# EAGLE design I2C-9685-PWM (EAGLE 7.7.0)
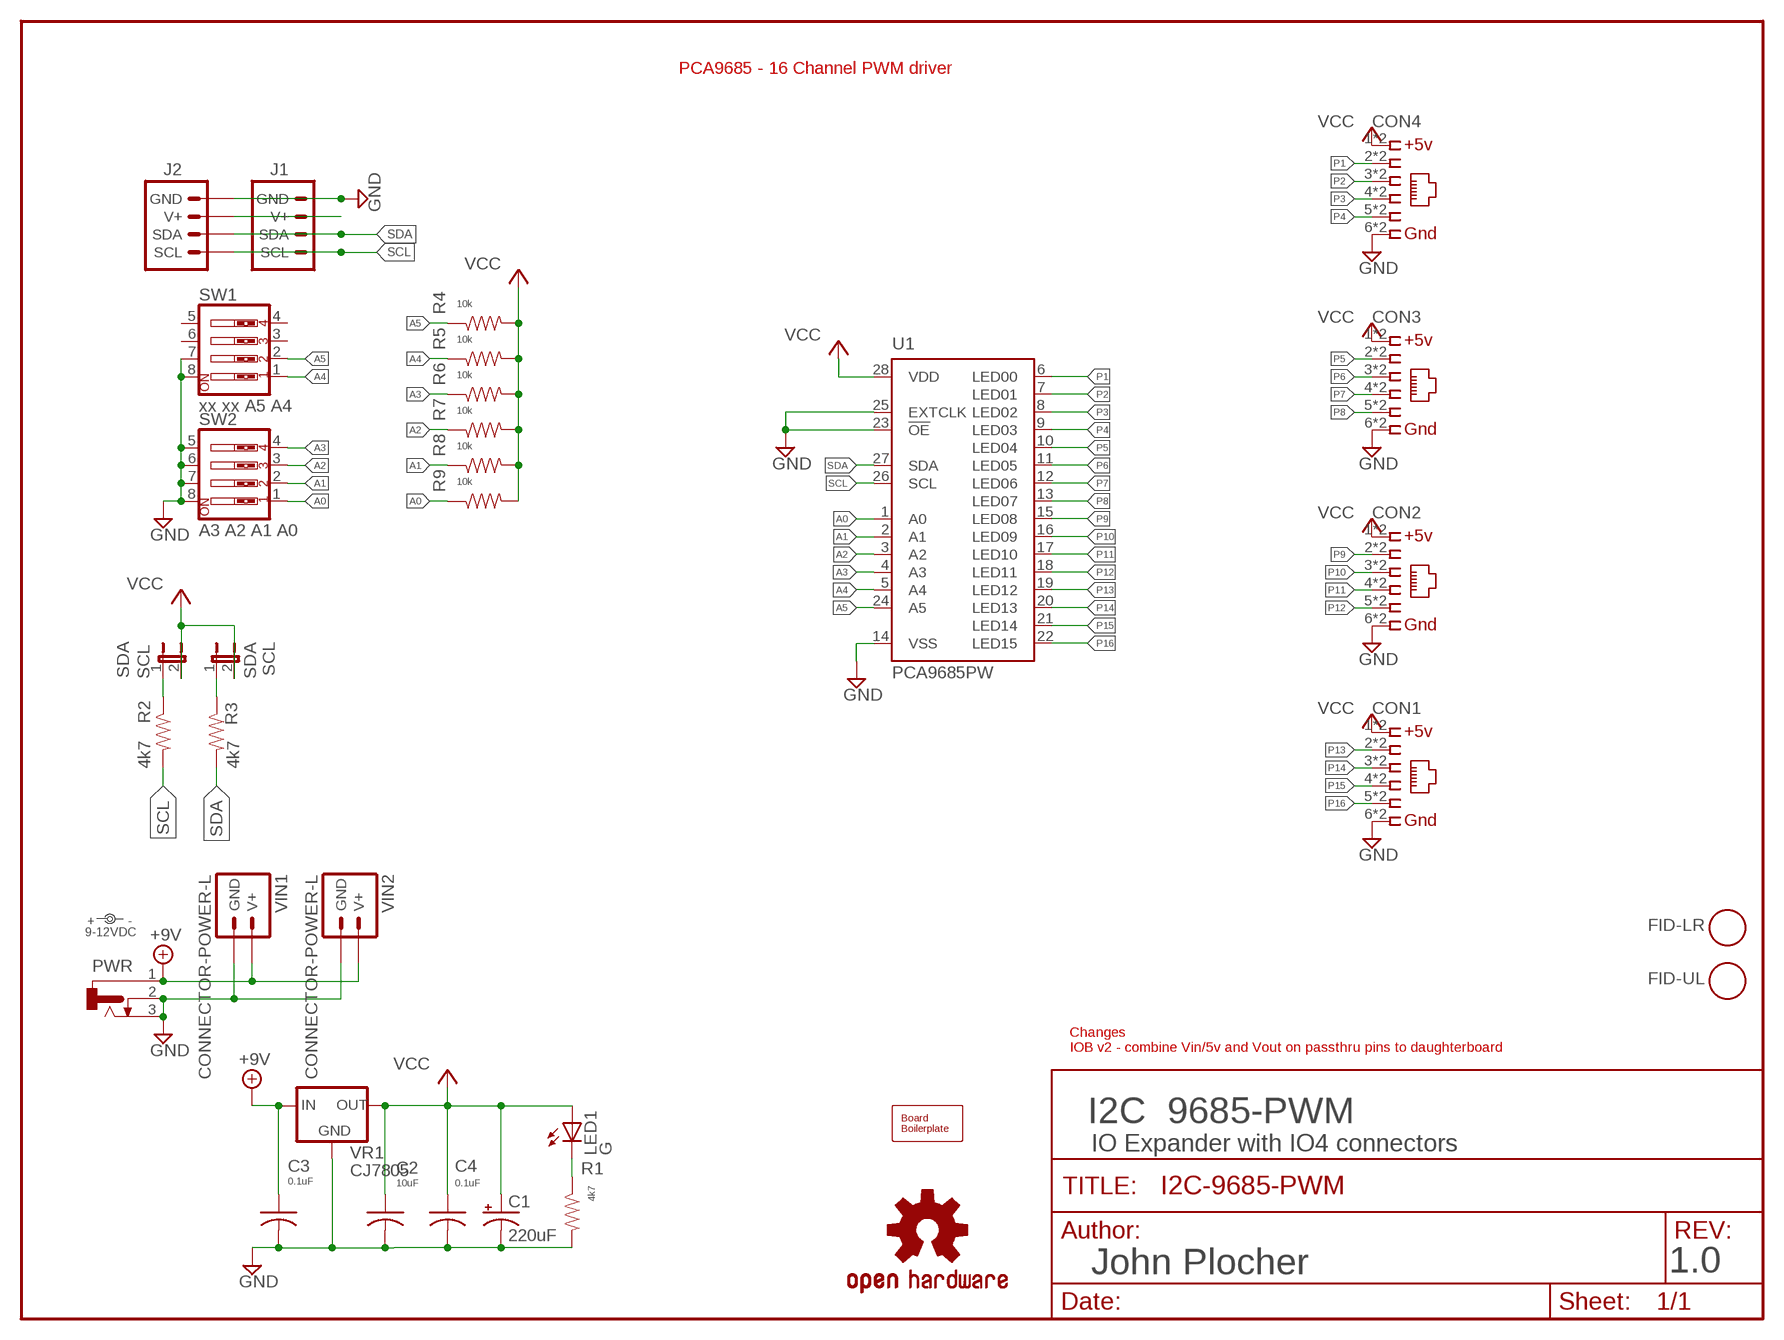
[diagram p0: schematic, sheet 1]

## Parts
BOARD1  BOARD80X100-IOB  [BOARD-DINRAIL-3.17IN-IOB]
C1  220uF  CAP-POL0810  [0810-CAP]
C2  10uF  CAP0805  [0805-CAP]
C3  0.1uF  CAP0805  [0805-CAP]
C4  0.1uF  CAP0805  [0805-CAP]
CON1  CONNECTOR-IO4IPINS  [RJ24-INVERTED-PINS]
CON2  CONNECTOR-IO4IPINS  [RJ24-INVERTED-PINS]
CON3  CONNECTOR-IO4IPINS  [RJ24-INVERTED-PINS]
CON4  CONNECTOR-IO4IPINS  [RJ24-INVERTED-PINS]
FID-LR  FIDUCIAL  [FIDUCIAL_1MM]
FID-UL  FIDUCIAL  [FIDUCIAL_1MM]
J1  CONNECTOR-I2CLEFT  [I2C-L]
J2  CONNECTOR-I2CLEFT  [I2C-L]
LED1  G  LED0603-LED  [0603-LED]
PWR  CONNECTOR-DC-POWER-RA  [DCJ0202]
R1  4k7  R0603-RES  [0603-RES]
R2  4k7  R0603-RES  [0603-RES]
R3  4k7  R0603-RES  [0603-RES]
R4  10k  R0603-RES  [0603-RES]
R5  10k  R0603-RES  [0603-RES]
R6  10k  R0603-RES  [0603-RES]
R7  10k  R0603-RES  [0603-RES]
R8  10k  R0603-RES  [0603-RES]
R9  10k  R0603-RES  [0603-RES]
SCL  SDA  JUMPER-2PTH_LOCK  [1X02_LOCK]
SDA  SCL  JUMPER-2PTH_LOCK  [1X02_LOCK]
SW1  xx xx A5 A4  SW_DIP-4  [EDG-04]
SW2  A3 A2 A1 A0  SW_DIP-4  [EDG-04]
U1  PCA9685PW  [TSSOP28]
U$1  OSHW-LOGOL  [OSHW-LOGO-L]
VIN  9-12VDC  DOC-POWER_LABEL  [PWR_LABEL]
VIN1  CONNECTOR-POWER-L  [POWER-R2]
VIN2  CONNECTOR-POWER-L  [POWER-R2]
VR1  CJ7805  VREG-DPAK-5  [TO-252]

## Nets
+9V [Power]: C3.1 PWR.1 VIN1.V+ VIN1.V+@1(V+) VIN1.V+@2(V+) VIN1.V+@3(V+) VIN2.V+ VIN2.V+@1(V+) VIN2.V+@2(V+) VIN2.V+@3(V+) VR1.1(IN)
A0 [signals]: R9.1 SW2.1 U1.1(A0)
A1 [signals]: R8.1 SW2.2 U1.2(A1)
A2 [signals]: R7.1 SW2.3 U1.3(A2)
A3: R6.1 SW2.4 U1.4(A3)
A4: R5.1 SW1.1 U1.5(A4)
A5: R4.1 SW1.2 U1.24(A5)
GND [Power]: C1.- C2.2 C3.2 C4.2 CON1.6 CON1.6@1 CON2.6 CON2.6@1 CON3.6 CON3.6@1 CON4.6 CON4.6@1 J1.GND J1.GND@1(GND) J2.GND J2.GND@1(GND) PWR.2 PWR.3 R1.2 SW1.7 SW1.8 SW2.5 SW2.6 SW2.7 SW2.8 U1.14(VSS) U1.23(!OE) U1.25(EXTCLK) VIN1.GND VIN1.GND@1(GND) VIN1.GND@2(GND) VIN1.GND@3(GND) VIN2.GND VIN2.GND@1(GND) VIN2.GND@2(GND) VIN2.GND@3(GND) VR1.2(GND)
N$1: LED1.C R1.1
N$19 [signals]: R3.1 SCL.1
N$20 [signals]: R2.1 SDA.1
P1 [signals]: CON4.2 CON4.2@1 U1.6(LED00)
P2 [signals]: CON4.3 CON4.3@1 U1.7(LED01)
P3 [signals]: CON4.4 CON4.4@1 U1.8(LED02)
P4 [signals]: CON4.5 CON4.5@1 U1.9(LED03)
P5 [signals]: CON3.2 CON3.2@1 U1.10(LED04)
P6 [signals]: CON3.3 CON3.3@1 U1.11(LED05)
P7 [signals]: CON3.4 CON3.4@1 U1.12(LED06)
P8 [signals]: CON3.5 CON3.5@1 U1.13(LED07)
P9 [signals]: CON2.2 CON2.2@1 U1.15(LED08)
P10 [signals]: CON2.3 CON2.3@1 U1.16(LED09)
P11 [signals]: CON2.4 CON2.4@1 U1.17(LED10)
P12 [signals]: CON2.5 CON2.5@1 U1.18(LED11)
P13 [signals]: CON1.2 CON1.2@1 U1.19(LED12)
P14 [signals]: CON1.3 CON1.3@1 U1.20(LED13)
P15 [signals]: CON1.4 CON1.4@1 U1.21(LED14)
P16 [signals]: CON1.5 CON1.5@1 U1.22(LED15)
SCL [signals]: J1.SCL J1.SCL@1(SCL) J2.SCL J2.SCL@1(SCL) R2.2 U1.26(SCL)
SDA [signals]: J1.SDA J1.SDA@1(SDA) J2.SDA J2.SDA@1(SDA) R3.2 U1.27(SDA)
V+I2C: J1.V+ J1.V+@1(V+) J2.V+ J2.V+@1(V+)
VCC [Power]: C1.+ C2.1 C4.1 CON1.1 CON1.1@1 CON2.1 CON2.1@1 CON3.1 CON3.1@1 CON4.1 CON4.1@1 LED1.A R4.2 R5.2 R6.2 R7.2 R8.2 R9.2 SCL.2 SDA.2 U1.28(VDD) VR1.3(OUT)
Unconnected: SW1.3 SW1.4 SW1.5 SW1.6

## Notes on the sheet
- PCA9685 - 16 Channel PWM driver
- Changes
  IOB v2 - combine Vin/5v and Vout on passthru pins to daughterboard
- I2C  9685-PWM
- IO Expander with IO4 connectors
- John Plocher | 1.0

## Library data of the parts
BOARD1 = SPCoast:BOARD
C1 = SPCoast:CAP-POL*
C2-C4 = SPCoast:CAP*
CON1-CON4 = SPCoast:CONNECTOR-IO4
FID-LR FID-UL = SPCoast:FIDUCIAL: For use by pick and place machines to calibrate the vision/machine, 1mm By microbuilder.eu
J1 J2 = SPCoast:CONNECTOR-I2C
LED1 = SPCoast:LED*
PWR = SPCoast:CONNECTOR-DC-POWER: DC POWER JACK
R1-R9 = SPCoast:R*: Resistor Basic schematic elements and footprints for 0603, 1206, and PTH 1/10th watt (small) resistors.
SCL SDA = SPCoast:JUMPER-2: Jumper Basic 0.1" spaced jumper. Use with breakaway headers.
SW1 SW2 = SPCoast:SW_DIP-4: DIP SWITCH
U1 = SPCoast:PCA9685
U$1 = SparkFun:OSHW-LOGO: Open Source Hardware Logo This logo indicates the piece of hardware it is found on incorporates a OSHW license and/or adheres to the definition of open source hardware found here: http://freedomdefined.org/OSHW
VIN = SPCoast:DOC-POWER_LABEL
VIN1 VIN2 = SPCoast:CONNECTOR-POWER
VR1 = SPCoast:VREG-?-*: Voltage Regulator Standard linear regulator. 7805 uses IGO pinout LM1117 uses GOI pinout

## Net classes
0 default: width 0.254 mm, drill 0.4 mm, clearance 0.127 mm
1 Power: width 0.254 mm, drill 0.4 mm, clearance 0.127 mm
2 signals: width 0.254 mm, drill 0.4 mm, clearance 0.127 mm

## Board
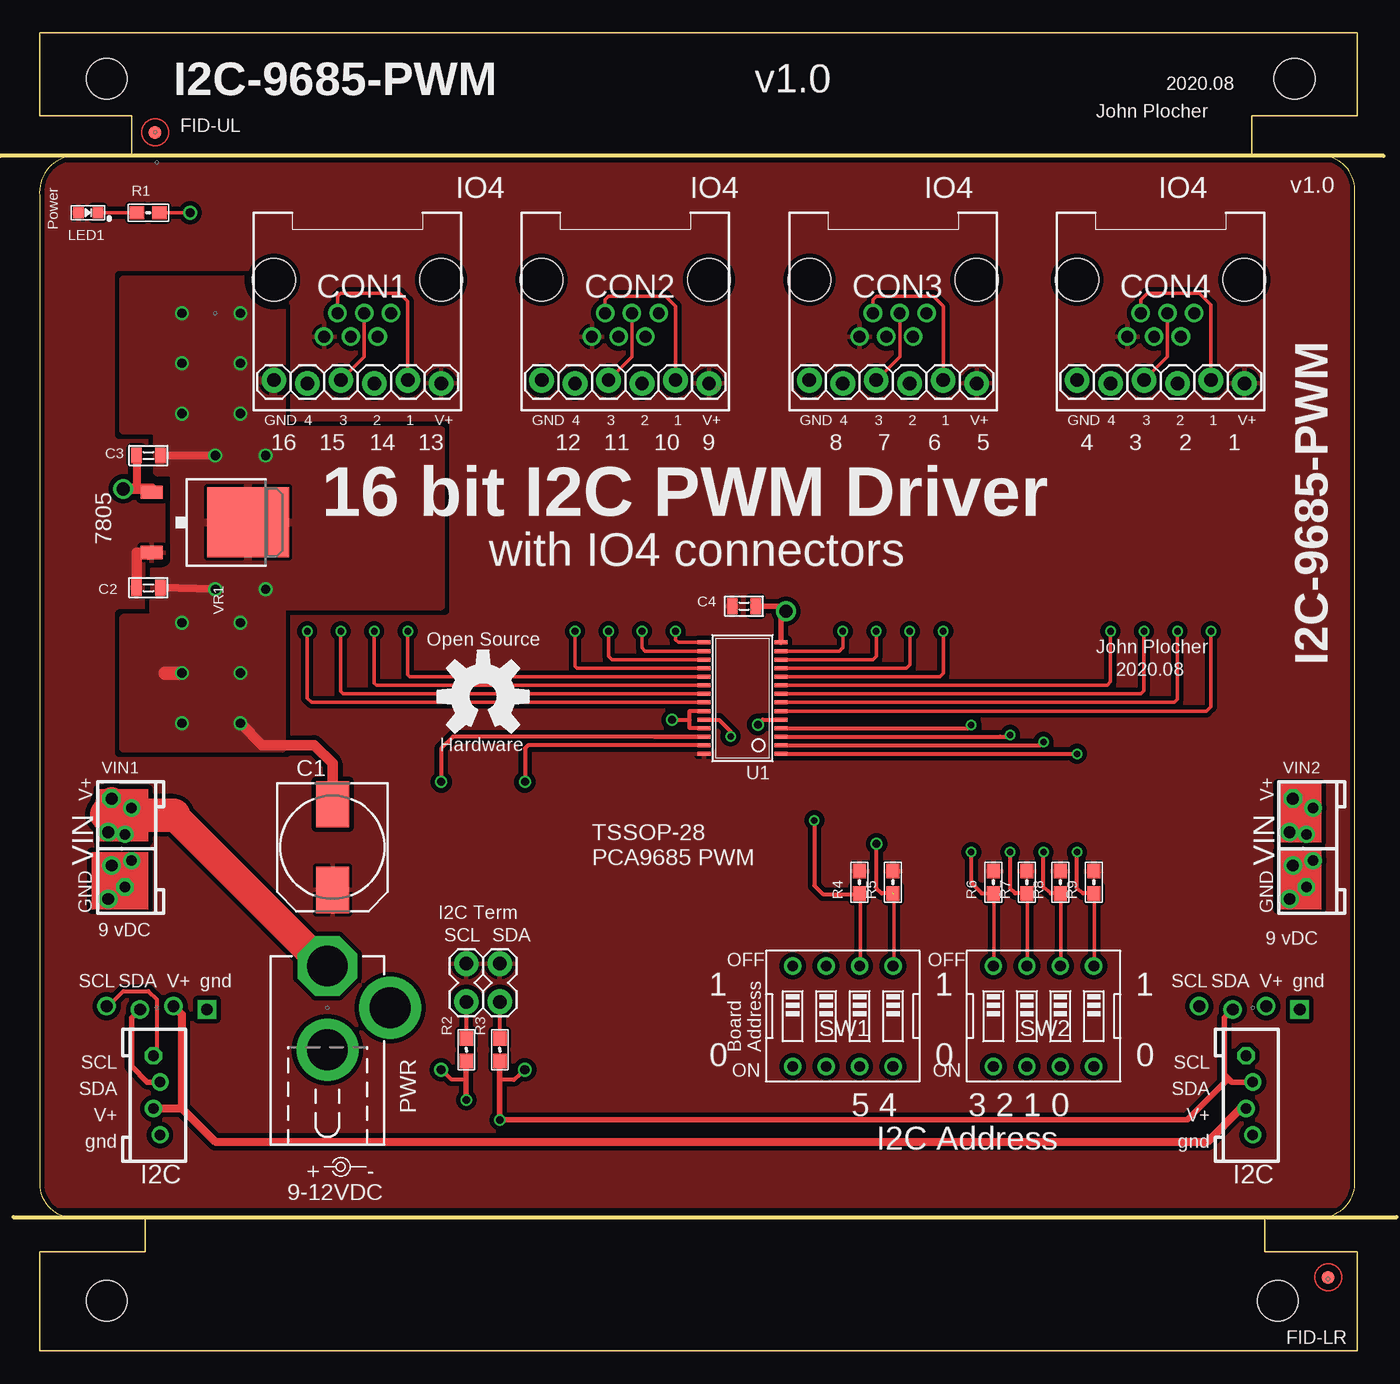
[diagram p1: board, top side]
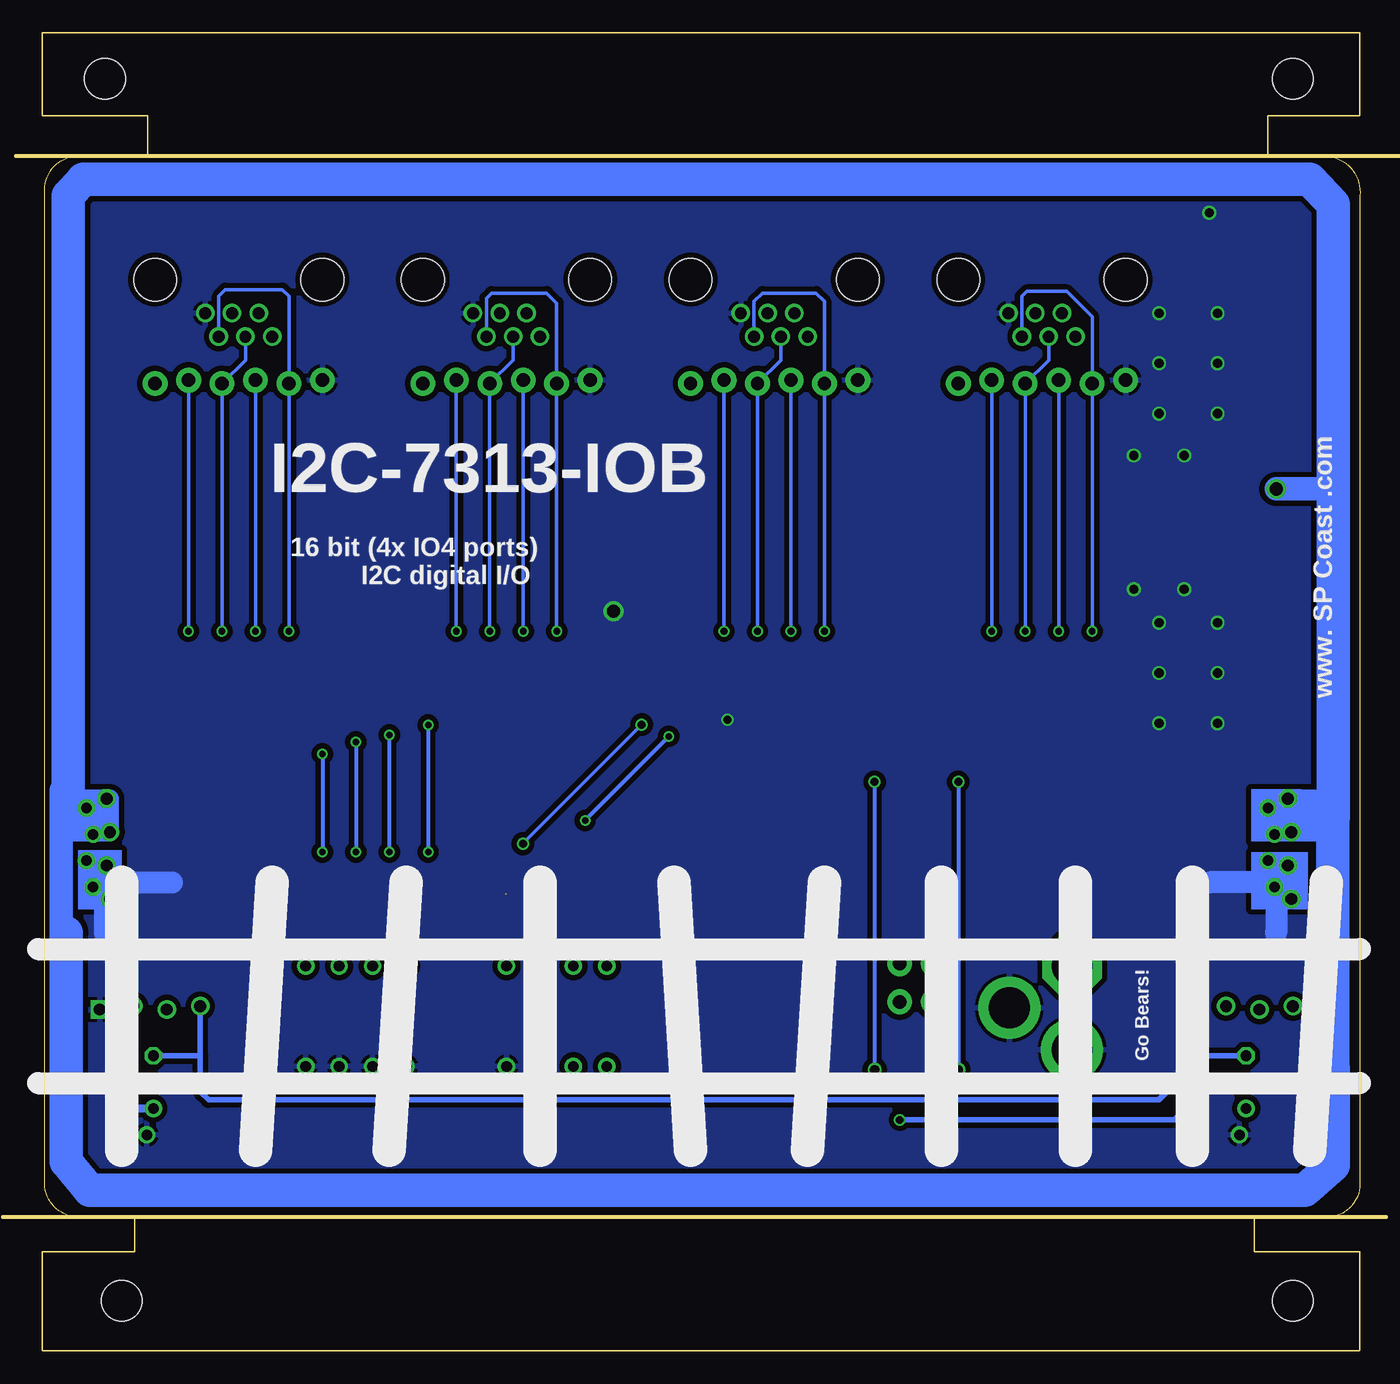
[diagram p2: board, bottom side, seen from below]

Size 100.01 x 100 mm. Coordinates in mm from the lower left corner, seen from the top.
Copper layers (1*16): Top 0.035mm / dielectric 1.5mm / Bottom 0.035mm
Design rules "Fusion_eagle_rule_v1.1": minimum track width 6mil, minimum drill 12mil, track to track 6mil, track to pad 6mil, pad to pad 6mil, via to via 6mil, smd to smd 0mil, copper to edge 10mil, drill to drill 10mil, minimum pad ring 10mil, minimum via ring 6mil, stop-mask expansion 2mil, vias tented up to drill 100mil, thermal gap 10mil

### Footprints (pad centres in the part's own frame; a part is rotated, then mirrored left to right if it is on the bottom)
BOARD-DINRAIL-3.17IN-IOB = hole 3.1: 5.08,96.52; 95.25,96.52; 5.08,3.81; 93.98,3.81
0810-CAP = smd 3.5 x 2.5: + 3.25,0; - -3.25,0
0805-CAP = smd 0.8 x 1.2: 1 -0.9,0; 2 0.9,0
RJ24-INVERTED-PINS = drill 1.016 pad 1.88: 1 6.35,-4.064; 2 3.81,-3.81; 3 1.27,-4.064; 4 -1.27,-3.81; 5 -3.81,-4.064; 6 -6.35,-3.81 | drill 0.9 pad 1.4: 1@1 -2.54,-0.508; 2@1 -1.524,1.27; 3@1 -0.508,-0.508; 4@1 0.508,1.27; 5@1 1.524,-0.508; 6@1 2.54,1.27 | hole 3.251: 6.35,3.81; -6.35,3.81
FIDUCIAL_1MM = smd 1 x 1: 1 0,0
I2C-L = drill 0.9 square: GND 3.81,-0.127 | drill 0.8 pad 1.27: GND@1 0.254,-9.635; SDA@1 0.254,-5.635; V+@1 -0.254,-7.635 | drill 0.9: SCL -3.81,0.127; SDA -1.27,-0.127; V+ 1.27,0.127 | drill 0.8 pad 1.27 octagon: SCL@1 -0.254,-3.635
0603-LED = smd 0.8 x 0.8: A 0.75,0; C -0.75,0
DCJ0202 = drill 3.1 pad 4.5 octagon: 1 0,3.175 | drill 3.1 pad 4.7: 2 4.763,0; 3 0,-3.175
0603-RES = smd 1.1 x 1: 1 -0.85,0; 2 0.85,0
1X02_LOCK = drill 1.016 pad 1.88: 1 -0.178,0; 2 2.718,0
EDG-04 = drill 0.813: 1 -3.81,-3.81; 2 -1.27,-3.81; 3 1.27,-3.81; 4 3.81,-3.81; 5 3.81,3.81; 6 1.27,3.81; 7 -1.27,3.81; 8 -3.81,3.81
TSSOP28 = smd 0.305 x 0.991: 1 -4.225,-2.918; 2 -3.575,-2.918; 3 -2.925,-2.918; 4 -2.275,-2.918; 5 -1.625,-2.918; 6 -0.975,-2.918; 7 -0.325,-2.918; 8 0.325,-2.918; 9 0.975,-2.918; 10 1.625,-2.918; 11 2.275,-2.918; 12 2.925,-2.918; 13 3.575,-2.918; 14 4.225,-2.918; 15 4.225,2.918; 16 3.575,2.918; 17 2.925,2.918; 18 2.275,2.918; 19 1.625,2.918; 20 0.975,2.918; 21 0.325,2.918; 22 -0.325,2.918; 23 -0.975,2.918; 24 -1.625,2.918; 25 -2.275,2.918; 26 -2.925,2.918; 27 -3.575,2.918; 28 -4.225,2.918
POWER-R2 = drill 0.9: GND -0.762,-1.27; GND@1 -1.016,-3.81; V+ -1.016,1.27 | drill 0.8 pad 1.27: GND@2 0.762,-0.904; V+@2 0.762,3.096; V+@3 0.254,1.096 | drill 0.8 pad 1.27 octagon: GND@3 0.254,-2.904 | drill 0.9 octagon: V+@1 -0.762,3.81
TO-252 = smd 1.651 x 1.016: 1 -4.826,2.286; 3 -4.826,-2.286 | smd 6.2 x 5.3: 2 2.5,0

### Placement (x,y rotation side)
BOARD1  0.01,0 0 top
C1  22.24,38.23 270 top
C2  8.27,57.91 0 top
C3  8.27,67.94 0 top
C4  53.48,56.52 0 top
CON1  24.14,77.47 0 top
CON2  44.46,77.47 0 top
CON3  64.78,77.47 0 top
CON4  85.1,77.47 0 top
FID-LR  97.8,5.59 0 top
FID-UL  8.78,92.46 0 top
J1  8.9,26.04 0 top
J2  91.83,26.04 0 top
LED1  3.7,86.36 180 top
PWR  21.86,26.04 0 top
R1  8.27,86.36 0 top
R2  32.4,22.86 270 top
R3  34.94,22.86 270 top
R4  62.24,35.56 90 top
R5  64.78,35.56 90 top
R6  72.4,35.56 90 top
R7  74.94,35.56 90 top
R8  77.48,35.56 90 top
R9  80.02,35.56 90 top
SCL  34.94,26.67 90 top
SDA  32.4,26.67 90 top
SW1  60.97,25.4 180 top
SW2  76.21,25.4 180 top
U1  53.35,49.53 90 top
U$1  33.67,49.66 0 top
VIN  22.87,13.97 90 top
VIN1  6.24,38.1 0 top
VIN2  95.9,38.1 0 top
VR1  13.35,62.87 0 top

### Tracks (layer width: path | path; a pad name or v marks a point on that pad's centre or on a via)
+9V  (via drill 1)
  Top 0.406: 8.51,65.14 VR1.1 8.52,65.41
  Top 0.61: C3.1 7.37,65.41
  Top 0.813: v6.36,65.41 7.37,65.41 8.52,65.41
  Top 1.778: 5.09,40.7 5.09,41.53 VIN1.V+@1
  Top 2.184: PWR.1 21.6,29.21 10.17,40.64
  Top 2.54: 10.17,40.64 5.16,40.64 5.09,40.7
  Bottom 0.254: 3.26,39.37 3.26,39.42 2.06,39.36
  Bottom 0.61: 98.06,41.78 97.37,41.1 97.34,41.1
  Bottom 0.813: 91.96,88.9 92.72,88.9 | 70.37,88.9 69.86,88.9 | 48.78,88.9 49.54,88.9 | 27.19,88.9 26.68,88.9 | 5.47,39.37 arc90 5.65,39.2 VIN1.V+@3 | VIN1.V+@2 VIN1.V+@1 | VIN2.V+ VIN2.V+@3
  Bottom 1.422: 2.68,40.64 2.68,41.91 VIN1.V+@1 | 5.47,39.37 VIN1.V+ 3.26,39.37 2.55,39.37 | 6.49,40.7 2.62,40.7 | 98.06,41.91 VIN2.V+@1 94.88,41.91 VIN2.V+ 97.8,39.37 97.8,40.64 95.26,40.64 95.26,41.2 VIN2.V+@2
  Bottom 1.778: v6.36,65.41 2.05,65.41 | 98.18,31.75 98.57,32 98.57,42.55
  Bottom 1.93: 2.05,41.27 2.62,40.7 2.68,40.64
  Bottom 2.184: 2.05,29.21 arc-45 2.05,29.21
  Bottom 2.54: 98.06,41.78 98.06,41.91 98.06,87.63 96.91,88.9 92.72,88.9 69.86,88.9 49.54,88.9 26.68,88.9 3.82,88.9 2.05,87 2.05,65.41 2.05,41.27 2.06,39.36 2.05,29.21 2.05,14.1 4.2,12.19 96.41,12.19 98.18,14.35 98.18,31.75
A0  (via drill 0.5)
  Top 0.254: SW2.1 80.07,29.26 80.07,34.65 R9.1
  Top 0.305: R9.1 79.2,34.71 78.75,35.08 v78.75,37.85 | U1.1 v78.75,45.3
  Bottom 0.305: v78.75,45.3 v78.75,37.85
A1  (via drill 0.5)
  Top 0.254: R8.1 77.53,34.65 77.53,29.26 SW2.2
  Top 0.305: R8.1 76.76,34.71 76.21,35.18 v76.21,37.85 | U1.2 75.83,45.97 75.98,45.97 v76.21,46.21
  Bottom 0.305: v76.21,46.21 v76.21,37.85
A2  (via drill 0.5)
  Top 0.254: R7.1 74.99,34.65 74.99,29.26 SW2.3
  Top 0.305: R7.1 74.07,34.71 73.67,35.08 v73.67,37.85 | U1.3 72.91,46.61 73.42,46.61 v73.67,46.74
  Bottom 0.305: v73.67,46.74 v73.67,37.85
A3  (via drill 0.5)
  Top 0.254: 72.35,34.75 R6.1 72.45,34.65 72.45,29.26 SW2.4
  Top 0.305: U1.4 70.12,47.24 70.46,47.24 v70.73,47.5 | R6.1 72.39,34.72 71.51,34.72 70.73,35.51 v70.73,37.85
  Bottom 0.305: v70.73,47.5 v70.73,37.85
A4  (via drill 0.6)  (1 unrouted)
  Top 0.254: 64.83,34.65 64.83,29.26 SW1.1
  Top 0.305: R5.1 63.91,34.71 63.54,35.08 v63.54,38.48 | v54.52,47.52 54.9,47.91 U1.5
  Bottom 0.254: v54.52,47.52 63.54,38.51 v63.54,38.48
A5  (via drill 0.5)
  Top 0.254: R4.1 62.29,34.65 62.29,29.26 SW1.2
  Top 0.305: U1.24 51.58,47.88 52.44,47.02 v52.46,46.63 | v58.81,40.26 58.81,35.31 59.45,34.67 62.2,34.67 R4.1
  Bottom 0.305: v52.46,46.63 58.81,40.28 v58.81,40.26
GND  (via drill 0.6, 0.7, 1)
  Top 0.254: R1.2 v11.44,86.36
  Top 0.305: U1.23 49.34,48.55 49.34,47.88 | U1.25 49.34,47.26 49.34,47.88 | v48.02,47.88 49.34,47.88
  Top 0.406: C4.2 56.27,56.52 v56.66,56.13 56.27,55.75 U1.14
  Top 0.61: v13.35,57.78 C2.2 | C3.2 v13.35,67.94
  Top 0.813: v15.25,47.62 16.9,45.97 20.84,45.97 22.24,44.58 C1.-
  Top 1.016: 9.54,51.44 v10.81,51.44
  Bottom 0.813: VIN1.GND@1 6.13,35.2 VIN1.GND@3 | VIN2.GND@2 96.29,36.83 VIN2.GND | VIN2.GND@3 96.15,34.29 VIN2.GND@1
  Bottom 1.016: VIN1.GND@2 6.63,36.83 VIN1.GND 6.49,35.81 VIN1.GND@3 6.85,35.56 | VIN1.GND@1 5.58,34.29
  Bottom 1.676: 6.85,35.56 11.44,35.56 | VIN1.GND@3 6.36,35.07 6.36,31.75 | VIN2.GND 95.14,35.56 90.18,35.56 | VIN2.GND@1 arc-90 95.26,33.91 95.26,31.75
  other vias: 17.16,67.94 17.16,57.78 15.25,71.12 15.25,55.24 10.81,71.12 10.81,55.24 10.81,74.93 15.25,74.93 10.81,78.74 15.25,78.74 15.25,51.44 10.81,47.62
  pour Bottom (isolate 0.406, rank 2): 100.01,10 100.01,90 0.01,90 0.01,10
  pour Top (isolate 0.61): 6.36,45.72 18.43,45.72 18.43,56.52 30.49,56.52 30.49,69.85 18.43,69.85 18.43,81.28 6.36,81.28 6.36,69.85 8.9,69.85 8.9,66.67 10.17,66.67 10.17,59.56 8.65,59.56 8.65,55.63 6.36,55.63
N$1
  Top 0.254: R1.1 LED1.C
N$19
  Top 0.305: SCL.1 R3.1
N$20
  Top 0.305: SDA.1 R2.1
P1  (via drill 0.5)
  Top 0.254: CON4.2@1 83.58,79.76 84.09,80.26 88.02,80.26 88.91,79.38 CON4.2 | v88.91,54.61 88.91,48.9 88.57,48.55 U1.6
  Bottom 0.254: CON4.2 v88.91,54.61
P2  (via drill 0.5)
  Top 0.254: v86.37,54.61 86.37,49.46 86.12,49.2 U1.7
  Bottom 0.254: v86.37,54.61 CON4.3 84.6,75.18 CON4.3@1
P3  (via drill 0.5)
  Top 0.254: CON4.4@1 85.61,75.44 CON4.4 | v83.83,54.61 83.83,50.11 83.58,49.85 U1.8
  Bottom 0.254: CON4.4 v83.83,54.61
P4  (via drill 0.5)
  Top 0.254: v81.29,54.61 81.29,50.76 81.04,50.51 U1.9
  Bottom 0.254: v81.29,54.61 CON4.5 81.29,80.01 81.8,80.52 86.12,80.52 86.63,80.01 CON4.5@1
P5  (via drill 0.5)
  Top 0.254: CON3.2@1 63.26,79.76 63.51,80.01 67.83,80.01 68.59,79.25 CON3.2 | v68.59,54.61 68.59,51.41 68.34,51.16 U1.10
  Bottom 0.254: CON3.2 v68.59,54.61
P6  (via drill 0.5)
  Top 0.254: v66.05,54.61 66.05,52.06 65.8,51.8 U1.11
  Bottom 0.254: v66.05,54.61 CON3.3 64.28,75.18 CON3.3@1
P7  (via drill 0.5)
  Top 0.254: CON3.4@1 65.29,75.44 CON3.4 | v63.51,54.61 63.51,52.71 63.26,52.45 U1.12
  Bottom 0.254: CON3.4 v63.51,54.61
P8  (via drill 0.5)
  Top 0.254: v60.97,54.61 60.97,53.34 60.95,53.34 60.72,53.1 U1.13
  Bottom 0.254: v60.97,54.61 CON3.5 60.97,79.5 61.74,80.26 65.93,80.26 66.31,79.88 CON3.5@1
P9  (via drill 0.5)
  Top 0.254: CON2.2@1 42.94,79.76 43.19,80.01 47.51,80.01 48.27,79.25 CON2.2 | v48.27,54.61 48.27,53.98 48.49,53.76 U1.15
  Bottom 0.254: CON2.2 v48.27,54.61
P10  (via drill 0.5)
  Top 0.254: v45.73,54.61 45.73,53.34 45.97,53.1 U1.16
  Bottom 0.254: v45.73,54.61 CON2.3 43.96,75.18 CON2.3@1
P11  (via drill 0.5)
  Top 0.254: CON2.4@1 44.97,75.44 CON2.4 | v43.19,54.61 43.19,52.7 43.44,52.45 U1.17
  Bottom 0.254: CON2.4 v43.19,54.61
P12  (via drill 0.5)
  Top 0.254: v40.65,54.61 40.65,51.94 40.79,51.8 U1.18
  Bottom 0.254: v40.65,54.61 CON2.5 40.65,79.63 41.29,80.26 45.35,80.26 45.99,79.63 CON2.5@1
P13  (via drill 0.5)
  Top 0.254: CON1.2 27.95,79.63 27.32,80.26 22.87,80.26 22.62,80.01 CON1.2@1 | v27.95,54.61 27.95,51.31 28.11,51.16 U1.19
  Bottom 0.254: CON1.2 v27.95,54.61
P14  (via drill 0.5)
  Top 0.254: v25.41,54.61 25.41,50.67 25.58,50.51 U1.20
  Bottom 0.254: CON1.3@1 23.64,75.18 CON1.3 v25.41,54.61
P15  (via drill 0.5)
  Top 0.254: CON1.4@1 24.65,75.44 CON1.4 | v22.87,54.61 22.87,50.04 23.06,49.85 U1.21
  Bottom 0.254: CON1.4 v22.87,54.61
P16  (via drill 0.5)
  Top 0.254: v20.33,54.61 20.33,49.53 20.66,49.2 U1.22
  Bottom 0.254: CON1.5@1 25.67,80.01 25.29,80.39 22.24,80.39 20.33,78.49 CON1.5 v20.33,54.61
SCL  (via drill 0.55, 0.6, 0.7)
  Top 0.254: 88,26.21 J2.SCL
  Top 0.305: J1.SCL 5.22,26.16 6.36,27.3 8.27,27.3 8.9,26.67 8.9,22.65 J1.SCL@1 | U1.26 46.62,46.6 50.81,46.61 31.38,46.61 30.49,45.72 v30.49,43.18 | v30.49,21.34 31.23,20.62 32.35,20.62 32.4,20.57
  Top 0.406: R2.2 32.4,20.57 v32.4,19.05
  Bottom 0.305: 30.57,19.1 30.62,19.05 | v30.49,43.18 v30.49,21.34
  Bottom 0.406: J1.SCL@1 11.9,22.4 15.25,19.05 30.62,19.05 v32.4,19.05 87.39,19.05 88.02,19.68 88.02,22.4 | 88.02,22.4 J2.SCL | J2.SCL@1 88.02,22.4
SDA  (via drill 0.55, 0.6, 0.7)
  Top 0.305: U1.27 37.08,45.95 36.84,45.72 v36.84,43.18 | v36.84,21.34 36.01,20.57 34.99,20.57 34.94,20.62
  Top 0.406: J1.SDA 7,25.27 7,21.59 8.19,20.4 J1.SDA@1 | J2.SDA 89.93,25.27 89.93,20.95 90.25,20.64 | 90.25,20.64 90.48,20.4 J2.SDA@1 | R3.2 34.94,20.62 v34.94,17.53 87.14,17.53 90.25,20.64
  Bottom 0.305: v36.84,43.18 v36.84,21.34
  Bottom 0.406: J1.SDA@1 11.36,20.4 14.11,17.53 v34.94,17.53
V+I2C
  Top 0.61: J1.V+ 10.81,25.53 10.81,18.41 | J1.V+@1 8.66,18.41 10.81,18.41 | 10.81,18.41 13.35,15.88 88.66,15.88 91.18,18.4 J2.V+@1
  Bottom 0.61: J2.V+@1 93.09,18.4 93.74,19.05 93.74,22.99 93.1,23.62 J2.V+
VCC
  Top 0.61: 8.27,60.33 VR1.3
  Top 0.813: C2.1 7.37,60.58 VR1.3
  pour Top (isolate 0.356, rank 2): 100.01,11 100.01,90 0.01,90 0.01,11
(copper drawn outside any net)
  shapes: Bottom area x3, Top area x4

### Text on the board
tPlace: 2020.08 | v1.0 | John Plocher | v1.0 | IO4 | IO4 | IO4 | IO4 | Power | 16 | 15 | 14 | 13 | 12 | 11 | 10 | 9 | 8 | 7 | 6 | 5 | 4 | 3 | 2 | 1 | 7805 | 16 bit I2C PWM Driver | with IO4 connectors | Open Source | John Plocher | 2020.08 | Hardware | TSSOP-28 / PCA9685 PWM | I2C Term | 9 vDC | 9 vDC | OFF | OFF | Board / Address | 1 / / 0 | 1 / / 0 | 1 / / 0 | ON | ON | 5 4 | 3 2 1 0 | I2C Address
bPlace: www. SP Coast .com | I2C-7313-IOB | 16 bit (4x IO4 ports) / I2C digital I/O | Go Bears!